# EAGLE design circuit-new (EAGLE 6.2)
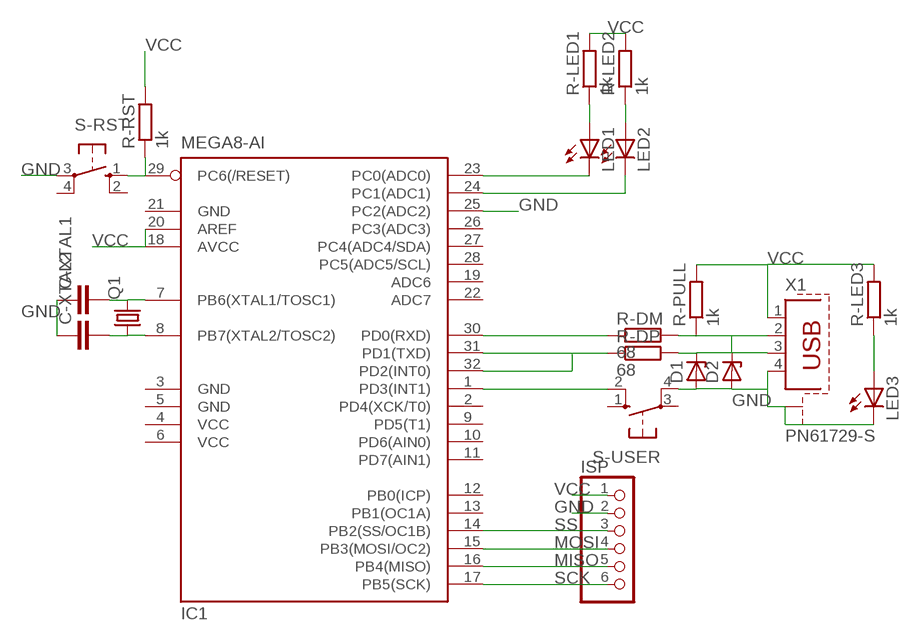
[diagram p0: schematic, sheet 1]

## Parts
C-XTAL1  C-EU025-024X044  [C025-024X044]
C-XTAL2  C-EU025-024X044  [C025-024X044]
D1  ZENER-DIODEDO34-7  [DO34Z7]
D2  ZENER-DIODEDO34-7  [DO34Z7]
IC1  MEGA8-AI  [TQFP32-08]
ISP  PINHD-1X6  [1X06]
LED1  LED3MM  [LED3MM]
LED2  LED3MM  [LED3MM]
LED3  LED3MM  [LED3MM]
Q1  CRYSTALHC49S  [HC49/S]
R-DM  68  R-EU_0204/7  [0204/7]
R-DP  68  R-EU_0204/7  [0204/7]
R-LED1  1k  R-EU_0204/7  [0204/7]
R-LED2  1k  R-EU_0204/7  [0204/7]
R-LED3  1k  R-EU_0204/7  [0204/7]
R-PULL  1k  R-EU_0204/7  [0204/7]
R-RST  1k  R-EU_0204/7  [0204/7]
S-RST  10-XX  [B3F-10XX]
S-USER  10-XX  [B3F-10XX]
X1  PN61729-S  [PN61729-S]

## Nets
GND: C-XTAL1.1 C-XTAL2.1 D1.A D2.A IC1.25(PC2(ADC2)) ISP.2 LED3.K(C) S-RST.3(P) S-USER.4(P1) X1.4 X1.S1 X1.S2
MISO: IC1.16(PB4(MISO)) ISP.5
MOSI: IC1.15(PB3(MOSI/OC2)) ISP.4
N$1: IC1.29(PC6(/RESET)) R-RST.1 S-RST.1(S)
N$3: C-XTAL1.2 IC1.7(PB6(XTAL1/TOSC1)) Q1.2
N$4: C-XTAL2.2 IC1.8(PB7(XTAL2/TOSC2)) Q1.1
N$11: IC1.24(PC1(ADC1)) LED2.K(C)
N$12: IC1.23(PC0(ADC0)) LED1.K(C)
N$21: IC1.30(PD0(RXD)) R-DM.1
N$23: IC1.31(PD1(TXD)) IC1.32(PD2(INT0)) R-DP.1
N$24: IC1.1(PD3(INT1)) S-USER.2(S1)
N$31: LED1.A R-LED1.1
N$32: LED2.A R-LED2.1
N$40: D1.C R-DP.2 X1.3
N$41: D2.C R-DM.2 R-PULL.1 X1.2
N$42: LED3.A R-LED3.1
SCK: IC1.17(PB5(SCK)) ISP.6
SS: IC1.14(PB2(SS/OC1B)) ISP.3
VCC: IC1.18(AVCC) IC1.20(AREF) ISP.1 R-LED1.2 R-LED2.2 R-LED3.2 R-PULL.2 R-RST.2 X1.1
Unconnected: IC1.2(PD4(XCK/T0)) IC1.9(PD5(T1)) IC1.10(PD6(AIN0)) IC1.11(PD7(AIN1)) IC1.12(PB0(ICP)) IC1.13(PB1(OC1A)) IC1.19(ADC6) IC1.22(ADC7) IC1.26(PC3(ADC3)) IC1.27(PC4(ADC4/SDA)) IC1.28(PC5(ADC5/SCL)) S-RST.2(S1) S-RST.4(P1) S-USER.1(S) S-USER.3(P)

## Power pins joined to a net without a drawn wire
GND: IC1.3(GND) IC1.5(GND) IC1.21(GND)
VCC: IC1.4(VCC) IC1.6(VCC)

## Library data of the parts
C-XTAL1 C-XTAL2 = resistor:C-EU: CAPACITOR, European symbol
D1 D2 = diode:ZENER-DIODE: Z-Diode
IC1 = atmel:MEGA8: MICROCONTROLLER 8 Kbytes FLASH, 1 kbytes SRAM, 512 bytes EEPROM, USART, 6-channel 10 bit ADC, 2-channel 8 bit ADC Pin compatible with Atmega48, ATMega88, ATMega168 Source: avr.lbr; MPN: ATMEGA8-16AU; OC_FARNELL: 9171371; OC_NEWARK: 73M8863
ISP = pinhead:PINHD-1X6: PIN HEADER
LED1-LED3 = led:LED: LED OSRAM: - CHIPLED LG R971, LG N971, LY N971, LG Q971, LY Q971, LO R971, LY R971 LH N974, LH R974 LS Q976, LO Q976, LY Q976 LO Q996 - Hyper CHIPLED LW Q18S LB Q993, LB Q99A, LB R99A - SideLED LS A670, LO A670, LY A670, LG A670, LP A670 LB A673, LV A673, LT A673, LW A673 LH A674 LY A675 LS A676, LA A676, LO A676, LY A676, LW A676 LS A679, LY A679, LG A679 - Hyper Micro SIDELED® LS Y876, LA Y876, LO Y876, LY Y876 LT Y87S - SmartLED LW L88C, LW L88S LB L89C, LB L89S, LG L890 LS L89K, LO L89K, LY L89K LS L896, LA L896, LO L896, LY L896 - TOPLED LS T670, LO T670, LY T670, LG T670, LP T670 LSG T670, LSP T670, LSY T670, LOP T670, LYG T670 LG T671, LOG T671, LSG T671 LB T673, LV T673, LT T673, LW T673 LH T674 LS T676, LA T676, LO T676, LY T676, LB T676, LH T676, LSB T676, LW T676 LB T67C, LV T67C, LT T67C, LS T67K, LO T67K, LY T67K, LW E67C LS E67B, LA E67B, LO E67B, LY E67B, LB E67C, LV E67C, LT E67C LW T67C LS T679, LY T679, LG T679 LS T770, LO T770, LY T770, LG T770, LP T770 LB T773, LV T773, LT T773, LW T773 LH T774 LS E675, LA E675, LY E675, LS T675 LS T776, LA T776, LO T776, LY T776, LB T776 LHGB T686 LT T68C, LB T68C - Hyper Mini TOPLED® LB M676 - Mini TOPLED Santana® LG M470 LS M47K, LO M47K, LY M47K Source: http://www.osram.convergy.de LUXEON: - LUMILED® LXK2-PW12-R00, LXK2-PW12-S00, LXK2-PW14-U00, LXK2-PW14-V00 LXK2-PM12-R00, LXK2-PM12-S00, LXK2-PM14-U00 LXK2-PE12-Q00, LXK2-PE12-R00, LXK2-PE12-S00, LXK2-PE14-T00, LXK2-PE14-U00 LXK2-PB12-K00, LXK2-PB12-L00, LXK2-PB12-M00, LXK2-PB14-N00, LXK2-PB14-P00, LXK2-PB14-Q00 LXK2-PR12-L00, LXK2-PR12-M00, LXK2-PR14-Q00, LXK2-PR14-R00 LXK2-PD12-Q00, LXK2-PD12-R00, LXK2-PD12-S00 LXK2-PH12-R00, LXK2-PH12-S00 LXK2-PL12-P00, LXK2-PL12-Q00, LXK2-PL12-R00 Source: www.luxeon.com KINGBRIGHT: KA-3528ASYC Source: www.kingbright.com
Q1 = crystal:CRYSTAL: CRYSTAL; OC_FARNELL: 1667008; OC_NEWARK: unknown
R-DM R-DP R-LED1-R-LED3 R-PULL R-RST = resistor:R-EU_: RESISTOR, European symbol
S-RST S-USER = switch-omron:10-XX: OMRON SWITCH; MPN: B3F-1000; OC_FARNELL: 176432; OC_NEWARK: 36M3542
X1 = con-berg:PN61729-S: BERG USB connector; OC_FARNELL: unknown; OC_NEWARK: unknown

## Board
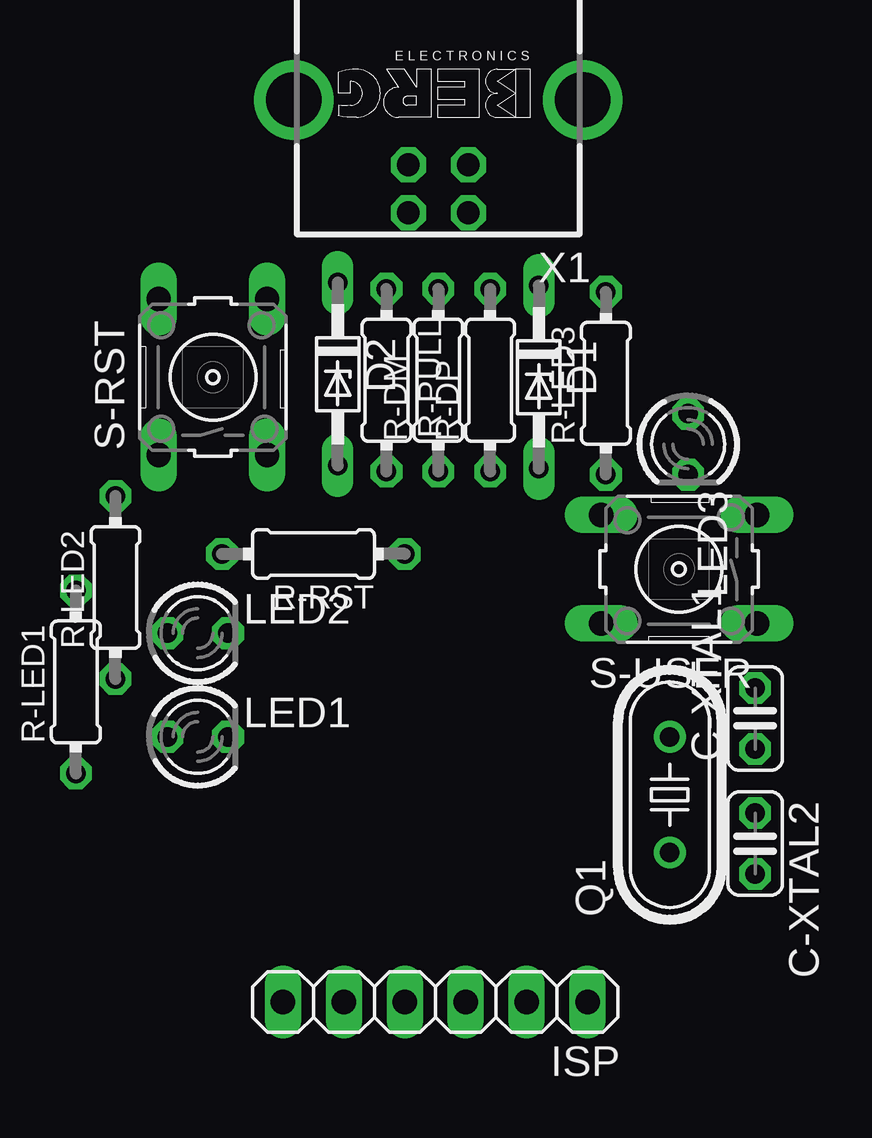
[diagram p1: board, top side]
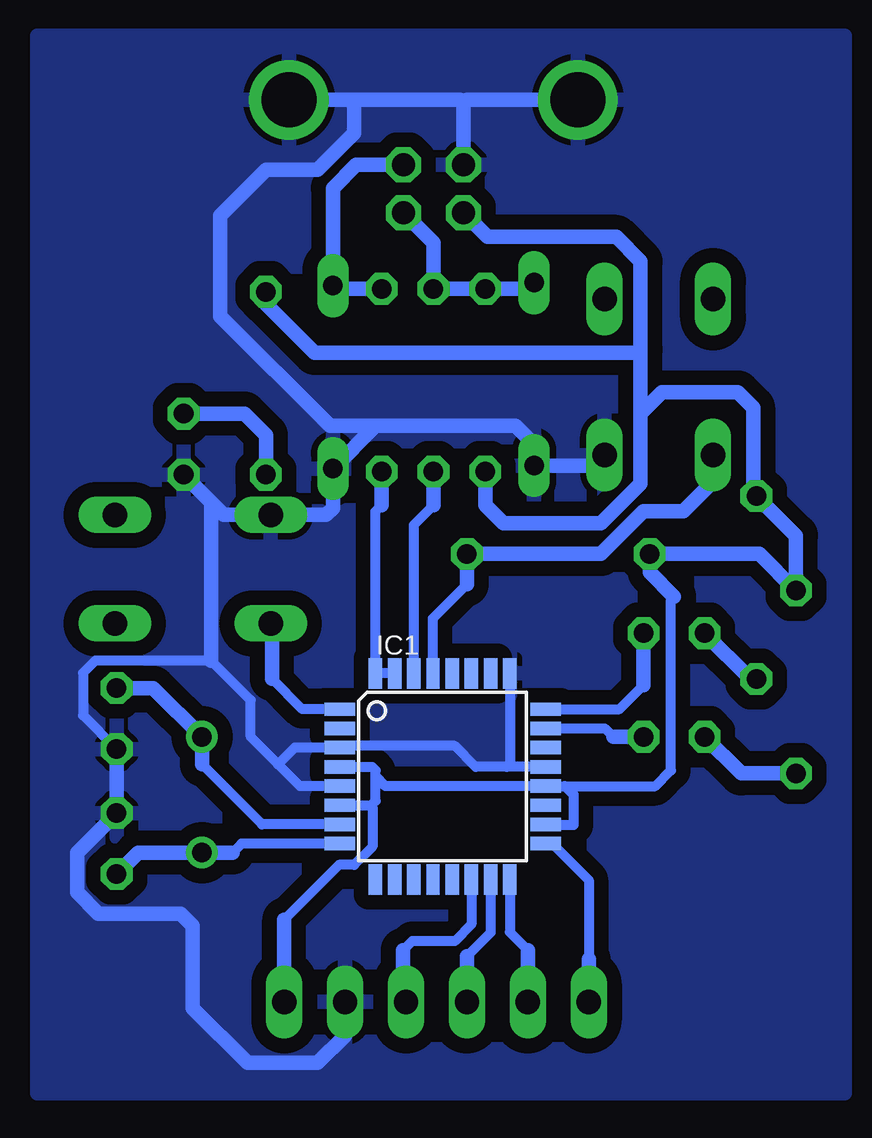
[diagram p2: board, bottom side, seen from below]

No outline drawn. Coordinates in mm, seen from the top.
Copper layers (1*16): Top 0.035mm / dielectric 1.5mm / Bottom 0.035mm
Design rules: minimum track width 10mil, minimum drill 24mil, track to track 8mil, track to pad 8mil, pad to pad 8mil, via to via 8mil, smd to smd 8mil, copper to edge 40mil, drill to drill 8mil, minimum pad ring 10mil, minimum via ring 8mil, stop-mask expansion 4mil, vias tented up to drill 0mil, thermal gap 10mil

### Footprints (pad centres in the part's own frame; a part is rotated, then mirrored left to right if it is on the bottom)
C025-024X044 = drill 0.813 octagon: 1 -1.27,0; 2 1.27,0
DO34Z7 = drill 0.813 long: A 3.81,0; C -3.81,0
TQFP32-08 = smd 1.27 x 0.559: 1 -4.293,2.8; 2 -4.293,2; 3 -4.293,1.2; 4 -4.293,0.4; 5 -4.293,-0.4; 6 -4.293,-1.2; 7 -4.293,-2; 8 -4.293,-2.8; 17 4.293,-2.8; 18 4.293,-2; 19 4.293,-1.2; 20 4.293,-0.4; 21 4.293,0.4; 22 4.293,1.2; 23 4.293,2; 24 4.293,2.8 | smd 0.559 x 1.27: 9 -2.8,-4.293; 10 -2,-4.293; 11 -1.2,-4.293; 12 -0.4,-4.293; 13 0.4,-4.293; 14 1.2,-4.293; 15 2,-4.293; 16 2.8,-4.293; 25 2.8,4.293; 26 2,4.293; 27 1.2,4.293; 28 0.4,4.293; 29 -0.4,4.293; 30 -1.2,4.293; 31 -2,4.293; 32 -2.8,4.293
1X06 = drill 1.016 long: 1 -6.35,0; 2 -3.81,0; 3 -1.27,0; 4 1.27,0; 5 3.81,0; 6 6.35,0
LED3MM = drill 0.813 octagon: A -1.27,0; K 1.27,0
HC49/S = drill 0.813: 1 -2.413,0; 2 2.413,0
0204/7 = drill 0.813 octagon: 1 -3.81,0; 2 3.81,0
B3F-10XX = drill 1.016 long: 1 -3.251,2.261; 2 3.251,2.261; 3 -3.251,-2.261; 4 3.251,-2.261
PN61729-S = drill 0.95 octagon: 1 1.25,4.71; 2 -1.25,4.71; 3 -1.25,2.71; 4 1.25,2.71 | drill 2.3 pad 2.9: S1 -6.02,0; S2 6.02,0

### Placement (x,y rotation side)
C-XTAL1  115.19,68.45 90 top
C-XTAL2  115.19,63.25 270 top
D1  106.17,82.68 270 top
D2  97.79,82.8 270 top
IC1  101.6,66.04 0 bottom
ISP  101.85,56.64 180 top
LED1  91.95,67.69 0 top
LED2  91.95,72.01 0 top
LED3  112.39,79.88 270 top
Q1  111.63,65.28 90 top
R-DM  101.98,82.55 90 top
R-DP  104.14,82.55 90 top
R-LED1  86.87,69.98 90 top
R-LED2  88.52,73.91 90 top
R-LED3  108.97,82.42 90 top
R-PULL  99.82,82.55 270 top
R-RST  96.77,75.31 180 top
S-RST  92.58,82.68 90 top
S-USER  112.01,74.68 180 top
X1  101.98,94.23 180 top

### Tracks (layer width: path | path; a pad name or v marks a point on that pad's centre or on a via)
GND
  Bottom 0.406: 108.46,66.55 107.77,67.24 IC1.3 105.82,67.31 101.09,67.31 100.22,66.44 98.93,66.44 | IC1.5 107.55,65.64 108.46,66.55 | 108.46,66.55 109.6,67.69 109.6,69.22 111.25,70.87 116.08,70.87 116.59,70.36 116.59,68.58 C-XTAL1.1 | IC1.21 98.93,66.44 | IC1.25 98.8,66.57 98.93,66.44
  Bottom 0.61: C-XTAL1.1 C-XTAL2.1 116.84,62.87 116.84,61.21 115.95,60.33 112.52,60.33 112.01,59.82 112.01,56.39 109.73,54.1 106.81,54.1 105.66,55.24 ISP.2 | 104.39,80.64 98.55,80.64 97.79,79.88 D2.A 95.28,78.99 S-RST.3 | 104.39,80.64 D1.A 106.17,77.22 106.45,76.94 S-USER.4 110.72,76.94 LED3.K 111.25,77.47 111.25,70.87 | X1.4 100.73,94.09 | 100.73,94.09 100.58,94.23 X1.S2 | X1.S1 105.28,94.23 | 105.28,94.23 100.88,94.23 100.73,94.09 | 104.39,80.64 106.3,80.64 110.87,85.22 110.87,89.41 108.97,91.31 106.81,91.31 105.28,92.84 105.28,94.23
  pour Bottom (isolate 0.61): 84.84,96.9 118.49,96.9 118.49,52.83 84.84,52.83
MISO
  Bottom 0.406: IC1.16 98.8,59.56 98.04,58.8
  Bottom 0.61: 98.04,58.8 ISP.5
MOSI
  Bottom 0.406: IC1.15 99.6,59.53 100.58,58.55
  Bottom 0.61: 100.58,58.55 ISP.4
N$1
  Bottom 0.406: IC1.29 102,72.62 100.58,74.04
  Bottom 0.61: 100.58,74.04 R-RST.1 95,75.31 93.22,77.09 91.57,77.09 90.3,78.36 90.3,79.4 S-RST.1
N$3
  Bottom 0.406: IC1.7 109.12,64.04 111.63,66.55
  Bottom 0.61: 111.63,66.55 Q1.2 113.67,69.72 C-XTAL1.2
N$4
  Bottom 0.406: IC1.8 109.99,63.24 110.36,62.87
  Bottom 0.61: 110.36,62.87 Q1.1 114.3,62.87 C-XTAL2.2
N$11
  Bottom 0.406: IC1.24 94.23,68.84 93.22,69.85
  Bottom 0.61: 93.22,69.85 LED2.K
N$12
  Bottom 0.406: IC1.23 94.84,68.04 94.49,67.69
  Bottom 0.61: LED1.K 94.49,67.69
N$21
  Bottom 0.406: IC1.30 102.8,76.52 101.98,77.34
  Bottom 0.61: 101.98,77.34 R-DM.1
N$23
  Bottom 0.406: IC1.31 IC1.32 104.4,77.08 104.14,77.34
  Bottom 0.61: 104.14,77.34 R-DP.1
N$24
  Bottom 0.406: IC1.1 107.45,68.84 108.71,70.1
  Bottom 0.61: 108.71,70.1 108.71,72.36 S-USER.2
N$31
  Bottom 0.61: R-LED1.1 89.15,66.17 LED1.A
N$32
  Bottom 0.61: R-LED2.1 88.77,70.1 LED2.A
N$40
  Bottom 0.61: R-DP.2 106.05,86.36 D1.C 106.17,90.55 105.2,91.52 X1.3
N$41
  Bottom 0.61: D2.C 98.04,86.36 R-PULL.1 R-DM.2 101.98,88.27 X1.2
N$42
  Bottom 0.61: R-LED3.1 108.97,80.26 109.86,81.15 LED3.A
SCK
  Bottom 0.406: IC1.17 97.02,63.24 95.5,61.72 95.5,58.42
  Bottom 0.61: 95.5,58.42 ISP.6
SS
  Bottom 0.406: IC1.14 100.4,59.87 101.09,59.18 102.87,59.18 103.25,58.8
  Bottom 0.61: 103.25,58.8 103.25,56.77 ISP.3
VCC
  Bottom 0.406: 104.39,66.04 104.39,65.02 104.58,64.84 IC1.6 104.59,64.84 104.52,64.77 104.52,63.12 105.28,62.36 105.92,62.36 108.2,60.07 | 104.39,66.04 104.39,66.29 104.54,66.44 IC1.4 | 96.5,65.64 IC1.20 103.99,65.64 104.39,66.04 | 96.5,65.64 96.14,65.28 96.14,64.01 97.28,64.01 IC1.18 | 96.5,65.64 92.73,65.64 92.08,66.29 92.08,73.41 91.95,73.53
  Bottom 0.61: R-PULL.2 99.82,77.34 99.06,76.58 95,76.58 93.34,78.23 93.34,81.15 | 93.34,81.15 93.34,83.82 | 93.34,83.82 93.34,87.5 94.36,88.52 99.73,88.52 X1.1 | R-LED3.2 108.97,85.72 106.93,83.69 93.47,83.69 93.34,83.82 | 93.34,81.15 92.46,82.04 89.28,82.04 88.65,81.41 88.65,77.85 R-LED2.2 86.87,76.07 R-LED1.2 88.39,75.31 R-RST.2 92.96,74.55 91.95,73.53 | ISP.1 108.2,60.07